# Altium schematic sheet custom_line_V1_mux4.SchDoc
size 209 x 297 mm
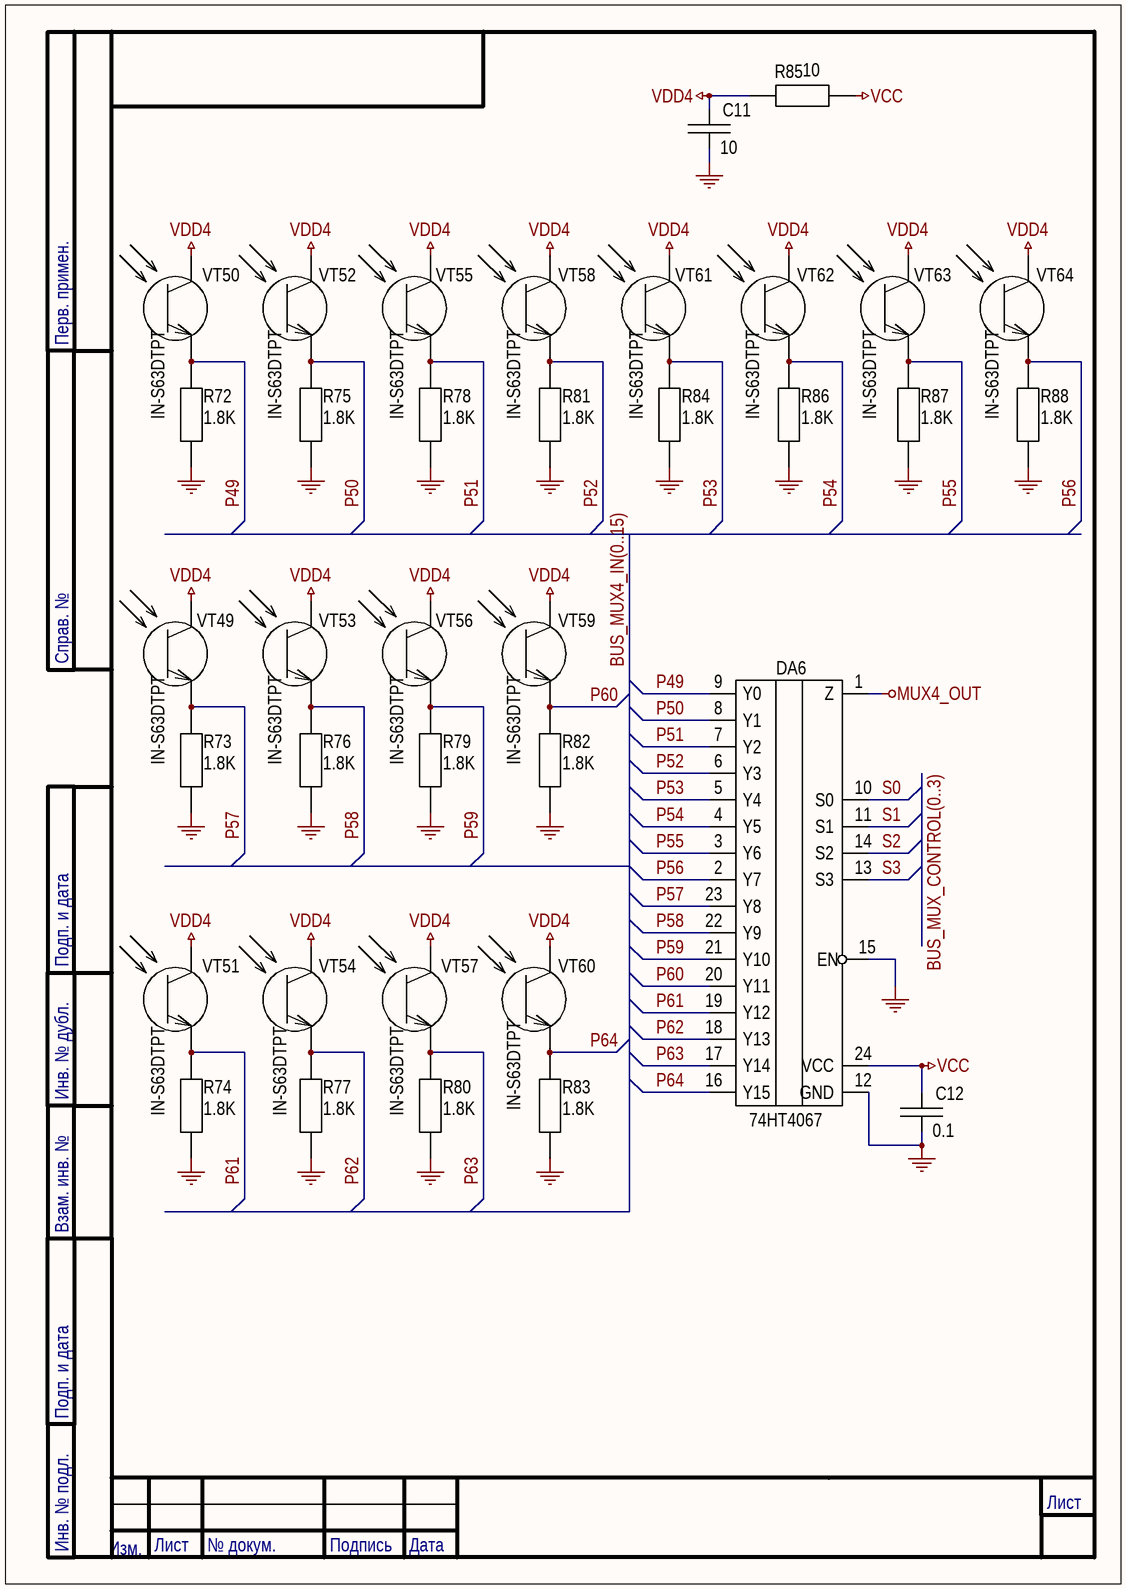
[diagram p0: custom_line_V1_mux4.SchDoc]

## Parts
C11  10  [CC_0805]
C12  0.1  [CC_0603]
DA6  type: 74HT4067  [TSSOP-24]  (hidden comment: 74HC4067)
R72  1.8K  [RC_0603_SMALL]
R73  1.8K  [RC_0603_SMALL]
R74  1.8K  [RC_0603_SMALL]
R75  1.8K  [RC_0603_SMALL]
R76  1.8K  [RC_0603_SMALL]
R77  1.8K  [RC_0603_SMALL]
R78  1.8K  [RC_0603_SMALL]
R79  1.8K  [RC_0603_SMALL]
R80  1.8K  [RC_0603_SMALL]
R81  1.8K  [RC_0603_SMALL]
R82  1.8K  [RC_0603_SMALL]
R83  1.8K  [RC_0603_SMALL]
R84  1.8K  [RC_0603_SMALL]
R85  10  [RC_0603_SMALL]
R86  1.8K  [RC_0603_SMALL]
R87  1.8K  [RC_0603_SMALL]
R88  1.8K  [RC_0603_SMALL]
VT49  IN-S63DTPT  [LED_0603]
VT50  IN-S63DTPT  [LED_0603]
VT51  IN-S63DTPT  [LED_0603]
VT52  IN-S63DTPT  [LED_0603]
VT53  IN-S63DTPT  [LED_0603]
VT54  IN-S63DTPT  [LED_0603]
VT55  IN-S63DTPT  [LED_0603]
VT56  IN-S63DTPT  [LED_0603]
VT57  IN-S63DTPT  [LED_0603]
VT58  IN-S63DTPT  [LED_0603]
VT59  IN-S63DTPT  [LED_0603]
VT60  IN-S63DTPT  [LED_0603]
VT61  IN-S63DTPT  [LED_0603]
VT62  IN-S63DTPT  [LED_0603]
VT63  IN-S63DTPT  [LED_0603]
VT64  IN-S63DTPT  [LED_0603]

## Nets
GND: C11.1 C12.1 DA6.12(GND) DA6.15(EN) R72.1 R73.1 R74.1 R75.1 R76.1 R77.1 R78.1 R79.1 R80.1 R81.1 R82.1 R83.1 R84.1 R86.1 R87.1 R88.1
MUX4_OUT: DA6.1(Z)
VCC: C12.2 DA6.24(VCC) R85.1
VDD4: C11.2 R85.2 VT49.1(C) VT50.1(C) VT51.1(C) VT52.1(C) VT53.1(C) VT54.1(C) VT55.1(C) VT56.1(C) VT57.1(C) VT58.1(C) VT59.1(C) VT60.1(C) VT61.1(C) VT62.1(C) VT63.1(C) VT64.1(C)
P49: DA6.9(Y0) R72.2 VT50.2(E)
P50: DA6.8(Y1) R75.2 VT52.2(E)
P51: DA6.7(Y2) R78.2 VT55.2(E)
P52: DA6.6(Y3) R81.2 VT58.2(E)
P53: DA6.5(Y4) R84.2 VT61.2(E)
P54: DA6.4(Y5) R86.2 VT62.2(E)
P55: DA6.3(Y6) R87.2 VT63.2(E)
P56: DA6.2(Y7) R88.2 VT64.2(E)
P57: DA6.23(Y8) R73.2 VT49.2(E)
P58: DA6.22(Y9) R76.2 VT53.2(E)
P59: DA6.21(Y10) R79.2 VT56.2(E)
P60: DA6.20(Y11) R82.2 VT59.2(E)
P61: DA6.19(Y12) R74.2 VT51.2(E)
P62: DA6.18(Y13) R77.2 VT54.2(E)
P63: DA6.17(Y14) R80.2 VT57.2(E)
P64: DA6.16(Y15) R83.2 VT60.2(E)
S0: DA6.10(S0)
S1: DA6.11(S1)
S2: DA6.14(S2)
S3: DA6.13(S3)

## Buses and harness runs
bus BUS_MUX4_IN(0..15)
bus BUS_MUX_CONTROL(0..3)

## Notes on the sheet
- Перв. примен.
- Справ. №
- Подп. и дата
- Инв. № дубл.
- Взам. инв. №
- Изм.
- Лист
- Инв. № подл.
- № докум.
- Подпись
- Дата

## Library data of the parts
C11 = C: type: CC-0805-106-16V-X7R-10%; value: 10uF
C12 = C: type: CC-0603-B-104-K-50; value: 0.1uF
DA6 = 74HCT4067: 74HC4067PW
R72-R84 R86-R88 = R: power: 0.125W; value: 100K; type: RC-0603-104-5%
R85 = R: power: 0.125W; type: RC-0603-R10-5%; value: 10
VT49-VT64 = phototransistor: Phototransistor (Inolux); type: IN-S63DTPT